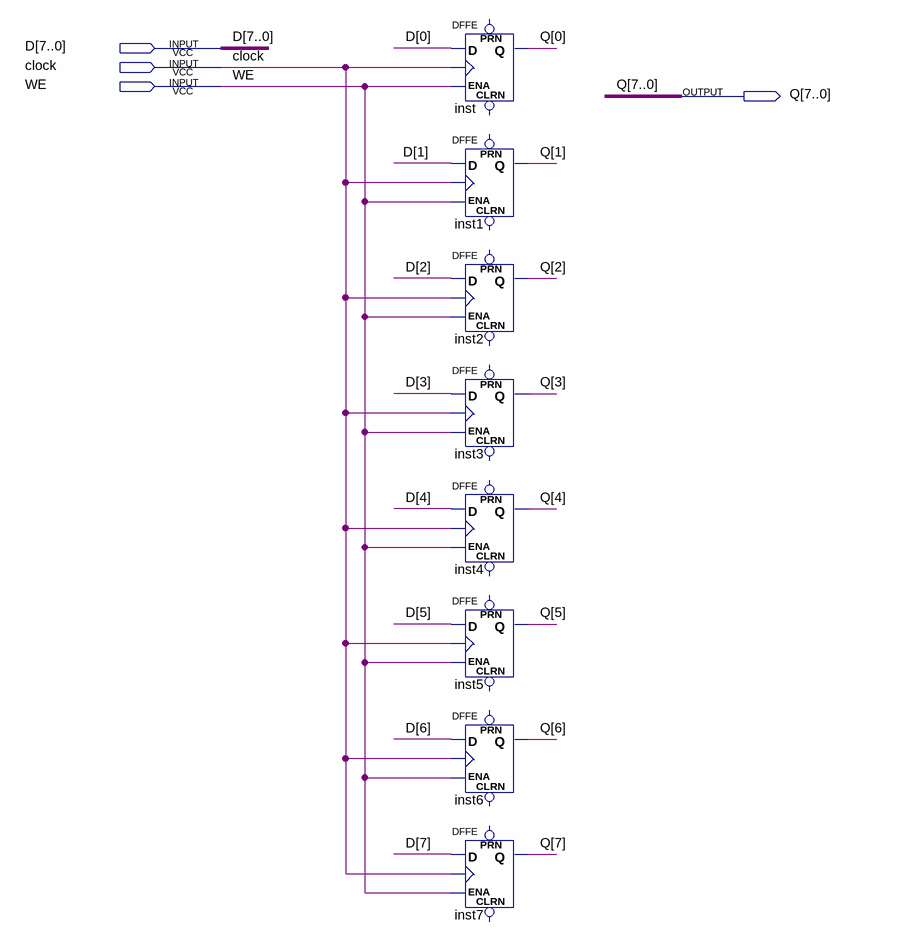
[diagram p0: schematic sheet]
// Quartus schematic register8.bdf as structural Verilog: 8 symbols, 4 pins
module register8 (
  input  [7:0] D,
  input  clock,
  input  WE,
  output [7:0] Q
);

  DFFE inst (.D(D[0]), .CLK(clock), .ENA(WE), .Q(Q[0]));  // open: PRN, CLRN
  DFFE inst1 (.D(D[1]), .CLK(clock), .ENA(WE), .Q(Q[1]));  // open: PRN, CLRN
  DFFE inst2 (.D(D[2]), .CLK(clock), .ENA(WE), .Q(Q[2]));  // open: PRN, CLRN
  DFFE inst3 (.D(D[3]), .CLK(clock), .ENA(WE), .Q(Q[3]));  // open: PRN, CLRN
  DFFE inst4 (.D(D[4]), .CLK(clock), .ENA(WE), .Q(Q[4]));  // open: PRN, CLRN
  DFFE inst5 (.D(D[5]), .CLK(clock), .ENA(WE), .Q(Q[5]));  // open: PRN, CLRN
  DFFE inst6 (.D(D[6]), .CLK(clock), .ENA(WE), .Q(Q[6]));  // open: PRN, CLRN
  DFFE inst7 (.D(D[7]), .CLK(clock), .ENA(WE), .Q(Q[7]));  // open: PRN, CLRN
endmodule
